# EasyEDA Pro project 电动自行车定位监测终端_v1.0.0.epro, board 主板PCB
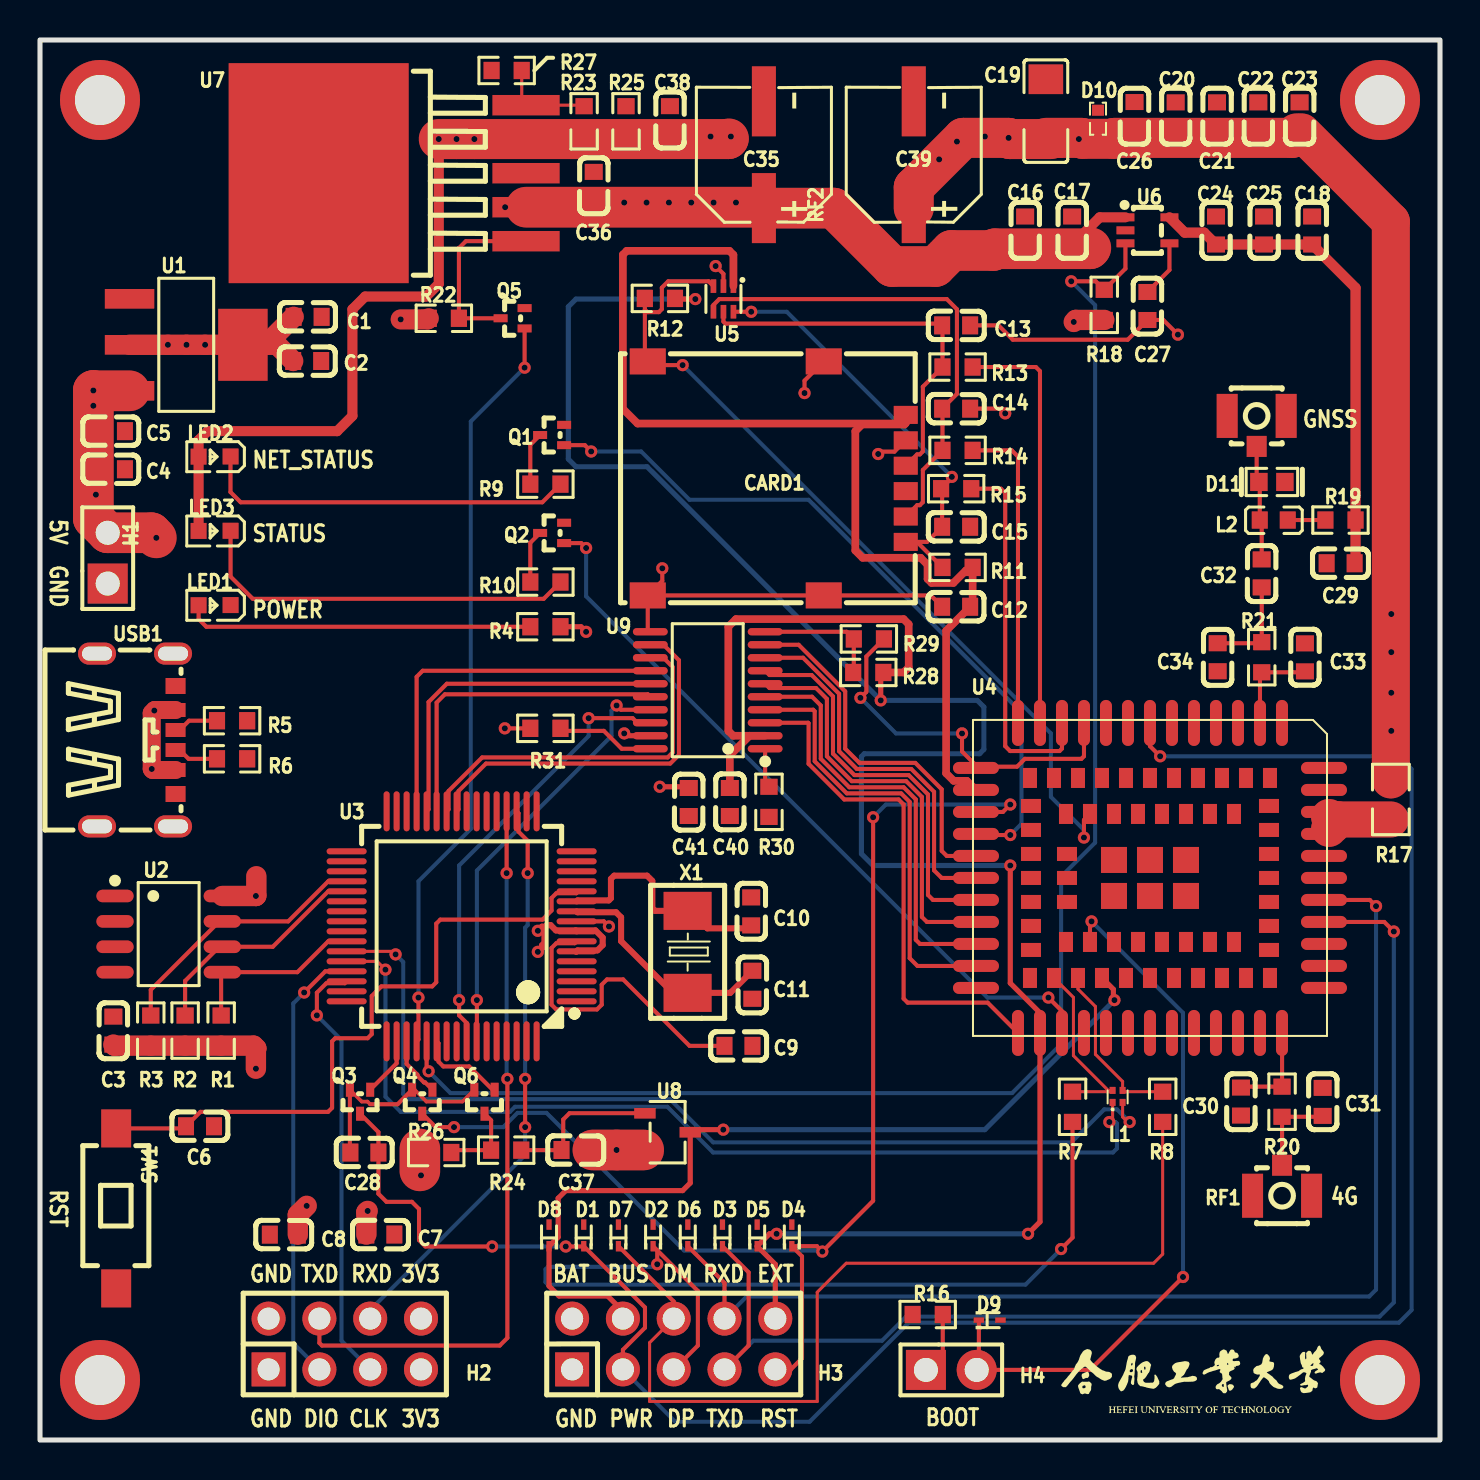
[diagram p3: board, top side]
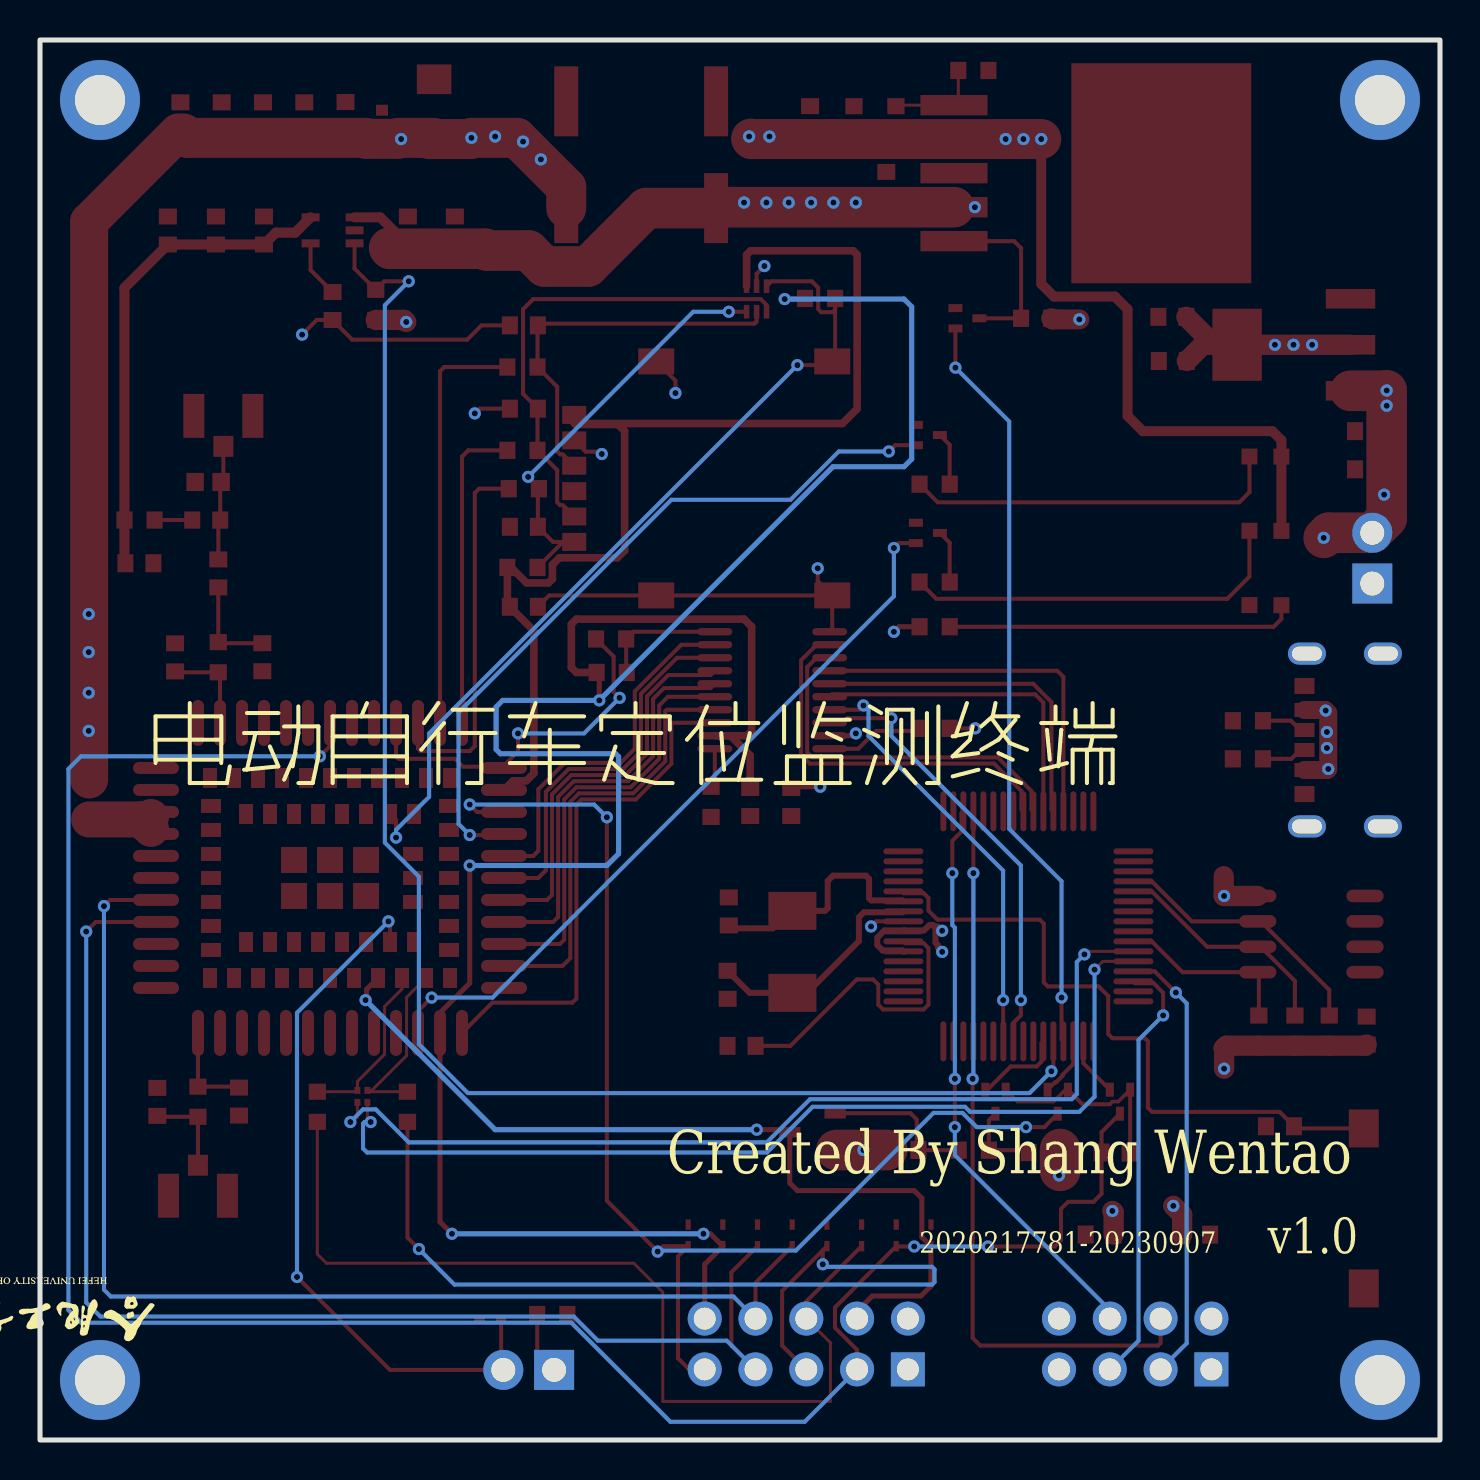
[diagram p4: board, bottom side, seen from below]

Outline 70 x 70 mm; copper layers: Top Layer, GND, PWR, Bottom Layer. Coordinates in mm from the lower left corner of the outline.
Outline path: rectangle 0,70 70,0
Stack: Top Layer 0.035mm 外层铜厚1oz / Dielectric1 0.2104mm 7628 RC49% 8.6mil / GND 0.0152mm 内层铜厚 / Dielectric2 1.065mm 1.1mm H/HOZ 含铜 / PWR 0.0152mm 内层铜厚 / Dielectric3 0.2104mm 7628 RC49% 8.6mil / Bottom Layer 0.035mm 外层铜厚1oz

## Design rules (mm)
net MCU_USB_DP: DP2
net MCU_USB_DM: DP2
net $1N2161: X1
net USB_DP_TEST: DP1
net USB_DM_TEST: DP1
net $1N19614: X1
template: 自定义配置
spacing copperThickness1oz (default): track to track 0.102, other pairs 0.152 to 0.3
spacing copperThickness2oz: track to track 0.203, other pairs 0.152 to 0.3
spacing copperThicknessInner0.5oz: track to track 0.089, other pairs 0.152 to 0.3
track width copperThickness1oz (default): min 0.102, default 0.203, max 0.203
track width copperThickness2oz: min 0.203, default 0.254, max 0.254
track width copperThickness0.5oz: min 0.089, default 0.203, max 2.54
track width 3V3: min 0.254, default 0.762, max 1.016
track width 3V8: min 0.254, default 1.016, max 2.54
track width 5V: min 0.254, default 2.032, max 3.048
track width 1V8: min 0.254, default 0.508, max 1.27
differential pair differentialPair (default): width min 0.127, default 0.254, max 2.54; gap min 0.152, default 0.152
via viaSize (default): diameter min 0.3, default 0.61, max 10; hole min 0.201, default 0.305, max 6.299
net 3V3 uses 3V3
net 5V uses 5V
net USB_VBUS uses 5V
net VBAT_MODULE uses 3V8
net VDD_EXT uses 1V8
net USIM1_VDD uses 1V8
net VBAT uses 3V8
net GNSS_VDD_3V3 uses 3V3

## Placement (name value [footprint] x y rotation side)
C1  100nF  [C0603]  13.38 56.16 0 top
C2  10uF  [C0603]  13.36 53.95 180 top
C3  100nF  [C0603]  3.67 20.47 90 top
C4  10uF  [C0603]  3.55 48.54 0 top
C5  100nF  [C0603]  3.55 50.44 0 top
C6  100nF  [C0603]  8 15.69 0 top
C7  100nF  [C0603]  17.02 10.27 180 top
C8  100nF  [C0603]  12.19 10.27 0 top
C9  100nF  [C0603]  34.92 19.71 180 top
C10  20pF  [C0603]  35.56 26.43 270 top
C11  20pF  [C0603]  35.62 22.76 90 top
C12  100nF  [C0603]  45.81 41.66 0 top
C13  33pF  [C0603]  45.81 55.73 180 top
C14  33pF  [C0603]  45.81 51.57 180 top
C15  33pF  [C0603]  45.81 45.66 180 top
C16  1uF  [C0603]  49.26 60.47 270 top
C17  100nF  [C0603]  51.61 60.47 270 top
C18  33pF  [C0603]  63.61 60.47 270 top
C19  100uF  [C1206]  50.29 66.44 270 top
C20  33pF  [C0603]  56.78 66.18 270 top
C21  10pF  [C0603]  58.85 66.18 270 top
C22  3.9pF  [C0603]  60.91 66.18 270 top
C23  1.8pF  [C0603]  62.98 66.18 270 top
C24  4.7uF  [C0603]  58.8 60.47 270 top
C25  100nF  [C0603]  61.2 60.47 270 top
C26  100nF  [C0603]  54.73 66.2 90 top
C27  10nF  [C0603]  55.37 56.7 90 top
C28  10nF  [C0603]  16.22 14.37 0 top
C29  100nF  [C0603]  65.03 43.84 0 top
C30  NM  [C0603]  60.05 16.92 90 top
C31  NM  [C0603]  64.13 16.91 270 top
C32  100pF  [C0603]  61.08 43.33 90 top
C33  NM  [C0603]  63.25 39.13 270 top
C34  NM  [C0603]  58.88 39.14 90 top
C35  470uF  [CAP-SMD_BD6.3-L6.6-W6.6-FD]  36.19 64.26 90 top
C36  100nF  [C0603]  27.69 62.71 270 top
C37  470nF  [C0603]  26.78 14.5 180 top
C38  100nF  [C0603]  31.5 65.99 270 top
C39  470uF  [CAP-SMD_BD6.3-L6.6-W6.6-FD]  43.69 64.26 90 top
C40  100nF  [C0603]  34.49 31.9 270 top
C41  100nF  [C0603]  32.44 31.9 90 top
CARD1  SMN-305-ARP7  [NANO-SIM-SMD_SMN-305-ARP7]  36.84 48.08 270 top
D1  ESD9L5.0ST5G  [SOD-923_L0.8-W0.6-LS1.0-RD]  27.19 10.23 90 top
D2  ESD9L5.0ST5G  [SOD-923_L0.8-W0.6-LS1.0-RD]  30.66 10.23 90 top
D3  ESD9L5.0ST5G  [SOD-923_L0.8-W0.6-LS1.0-RD]  34.12 10.23 90 top
D4  ESD9L5.0ST5G  [SOD-923_L0.8-W0.6-LS1.0-RD]  37.59 10.23 90 top
D5  ESD9L5.0ST5G  [SOD-923_L0.8-W0.6-LS1.0-RD]  35.86 10.23 90 top
D6  ESD9L5.0ST5G  [SOD-923_L0.8-W0.6-LS1.0-RD]  32.39 10.23 90 top
D7  ESD9L5.0ST5G  [SOD-923_L0.8-W0.6-LS1.0-RD]  28.92 10.23 90 top
D8  ESD9L5.0ST5G  [SOD-923_L0.8-W0.6-LS1.0-RD]  25.45 10.23 90 top
D9  ESD9L5.0ST5G  [SOD-923_L0.8-W0.6-LS1.0-RD]  47.48 5.99 0 top
D10  PESDNC2FD4V5B  [DFN1006-2L-BI]  52.9 66.06 90 top
D11  KPESD0603AV5  [D0603-BI-A]  61.59 47.9 180 top
H1  PZ254V-11-02P  [HDR-TH_2P-P2.54-V-M]  3.39 44.09 90 top
H2  PZ254V-12-8P  [HDR-TH_8P-P2.54-V-M-R2-C4-S2.54]  15.24 4.8 0 top
H3  PZ254V-12-10P  [HDR-TH_10P-P2.54-V-M-R2-C5-S2.54]  31.69 4.8 0 top
H4  PZ254V-11-02P  [HDR-TH_2P-P2.54-V-M]  45.57 3.5 0 top
L1  DLM0NSN900HY2D  [FILTER-SMD_4P-L0.9-W0.7-P0.50-BL-CW]  53.88 17.18 0 top
L2  47nH  [L0603]  61.69 46 180 top
LED1  XL-1608UGC-04  [LED0603-RD_GREEN]  8.73 41.74 180 top
LED2  XL-1608UBC-04  [LED0603-RD_BLUE]  8.73 49.17 180 top
LED3  XL-1608UBC-04  [LED0603-RD_BLUE]  8.73 45.46 180 top
NOREF  -  [Pad_e67]  3 3 90 top
NOREF#2  -  [Pad_e65]  67 67 270 top
NOREF#3  -  [Pad_e66]  67 3 180 top
NOREF#4  -  [Pad_e10]  3 67 0 top
Q1  DTC043ZEBTL  [SOT-416_L1.6-W0.8-P1.00-LS1.6-BR]  25.6 50.25 0 top
Q2  DTC043ZEBTL  [SOT-416_L1.6-W0.8-P1.00-LS1.6-BR]  25.6 45.35 0 top
Q3  DTC043ZEBTL  [SOT-416_L1.6-W0.8-P1.00-LS1.6-BR]  16 16.91 90 top
Q4  DTC043ZEBTL  [SOT-416_L1.6-W0.8-P1.00-LS1.6-BR]  19.11 16.91 90 top
Q5  DTC043ZEBTL  [SOT-416_L1.6-W0.8-P1.00-LS1.6-BR]  23.63 56.09 0 top
Q6  DTC043ZEBTL  [SOT-416_L1.6-W0.8-P1.00-LS1.6-BR]  22.22 16.91 90 top
R1  10kΩ  [R0603]  9.06 20.47 270 top
R2  10kΩ  [R0603]  7.26 20.47 270 top
R3  10kΩ  [R0603]  5.54 20.47 270 top
R4  510Ω  [R0603]  25.27 40.66 180 top
R5  5.1kΩ  [R0603]  9.6 35.96 180 top
R6  5.1kΩ  [R0603]  9.6 34.06 180 top
R7  NM-0R  [R0603]  51.63 16.66 90 top
R8  NM-0R  [R0603]  56.13 16.66 90 top
R9  2.2kΩ  [R0603]  25.27 47.79 0 top
R10  2.2kΩ  [R0603]  25.27 42.9 0 top
R11  15kΩ  [R0603]  45.88 43.63 0 top
R12  51kΩ  [R0603]  31 57.08 0 top
R13  0Ω  [R0603]  45.88 53.65 180 top
R14  0Ω  [R0603]  45.88 49.48 180 top
R15  0Ω  [R0603]  45.81 47.56 180 top
R16  4.7kΩ  [R0603]  44.38 6.27 0 top
R17  0Ω  [R0805]  67.54 32.03 270 top
R18  10kΩ  [R0603]  53.21 56.76 90 top
R19  10Ω  [R0603]  65.02 46 180 top
R20  0Ω  [R0603]  62.1 16.91 270 top
R21  0Ω  [R0603]  61.09 39.14 90 top
R22  51kΩ  [R0603]  20.19 56.09 0 top
R23  100kΩ  [R0603]  27.21 65.94 270 top
R24  100kΩ  [R0603]  23.31 14.49 0 top
R25  330Ω  [R0603]  29.3 65.94 270 top
R26  10kΩ  [R0603]  19.81 14.37 180 top
R27  47kΩ  [R0603]  23.33 68.48 0 top
R28  10kΩ  [R0603]  41.41 38.38 0 top
R29  120kΩ  [R0603]  41.44 40.05 180 top
R30  51kΩ  [R0603]  36.45 31.91 270 top
R31  51kΩ  [R0603]  25.27 35.58 0 top
RF1  BWIPX-1-001E  [IPEX-SMD_BWIPX-1-001E]  62.1 12.98 270 top
RF2  BWIPX-1-001E  [IPEX-SMD_BWIPX-1-001E]  60.83 50.44 90 top
SW1  TS-1101-C-W  [SW-SMD_L6.0-W3.3-LS8.0]  3.81 11.58 270 top
U1  AMS1117-3.3  [SOT-223-4_L6.5-W3.5-P2.30-LS7.0-BR]  7.31 54.76 180 top
U2  AT24C64M/TR  [SOP-8_L4.9-W3.9-P1.27-LS6.0-BL]  6.43 25.3 270 top
U3  STM32G0B0RET6  [LQFP-64_L10.0-W10.0-P0.50-LS12.0-BL]  21.08 25.68 90 top
U4  -  [EC800M-CN_QuecOpen]  55.5 28.1 270 top
U5  ESDA6V8AV6  [SOT-563-6_L1.6-W1.2-P0.50-LS1.6-BL]  34.17 57.05 180 top
U6  SGM2019-3.3YC5G/TR  [SC-70-5_L2.1-W1.3-P0.65-LS2.1-BR]  55.37 60.48 180 top
U7  MIC29302WU  [TO-263-5_L10.1-W8.7-P1.70-LS15.2-BR]  19.12 63.34 0 top
U8  SI2333CDS-T1-MS  [SOT-23-3_L3.0-W1.6-P1.90-LS2.8-BR]  31.38 15.39 180 top
U9  TXS0108EPWR  [TSSOP-20_L6.5-W4.4-P0.65-LS6.4-BL]  33.39 37.49 90 top
USB1  TYPE-C 6P(073)  [TYPE-C-SMD_TYPE-C-6P]  4.81 35 270 top
X1  8MHz  [CRYSTAL-SMD_L5.0-W3.2]  32.38 24.41 90 top

## Footprints (pads in the part's own frame, mm; a bottom-side part is the same pattern mirrored in y, then rotated)
C0603
  rect 0.8x0.9 smd: 1(-0.7,0) 2(0.7,0)
C1206
  rect 1.485x1.728 smd: 1(-1.593,0) 2(1.593,0)
CAP-SMD_BD6.3-L6.6-W6.6-FD
  rect 3.5x1.2 smd: 1(-2.67,0) 2(2.67,0)
CRYSTAL-SMD_L5.0-W3.2
  rect 1.9x2.4 smd: 1(-2.05,0) 2(2.05,0)
D0603-BI-A
  rect 0.873x0.907 smd: 1(-0.65,0) 2(0.65,0)
DFN1006-2L-BI
  rect 0.55x0.6 smd: 1(-0.425,0) 2(0.425,0)
EC800M-CN_QuecOpen
  oval 2.3x0.6 smd: 1(-7.75,6.6) 2(-7.75,5.5) 3(-7.75,4.4) 4(-7.75,3.3) 5(-7.75,2.2) 6(-7.75,1.1) 7(-7.75,0) 8(-7.75,-1.1) 9(-7.75,-2.2) 10(-7.75,-3.3) 11(-7.75,-4.4) 12(-7.75,-5.5) 13(-7.75,-6.6) 23(7.75,-6.6) 24(7.75,-5.5) 25(7.75,-4.4) 26(7.75,-3.3) 27(7.75,-2.2) 28(7.75,-1.1) 29(7.75,0) 30(7.75,1.1) 31(7.75,2.2) 32(7.75,3.3) 33(7.75,4.4) 34(7.75,5.5) 35(7.75,6.6)
  oval 0.6x2.3 smd: 14(-4.4,-8.7) 15(-3.3,-8.7) 16(-2.2,-8.7) 17(-1.1,-8.7) 18(0,-8.7) 19(1.1,-8.7) 20(2.2,-8.7) 21(3.3,-8.7) 22(4.4,-8.7) 36(4.4,8.7) 37(3.3,8.7) 38(2.2,8.7) 39(1.1,8.7) 40(0,8.7) 41(-1.1,8.7) 42(-2.2,8.7) 43(-3.3,8.7) 44(-4.4,8.7) 95(-5.5,-8.7) 96(5.5,-8.7) 97(5.5,8.7) 98(-5.5,8.7)
  rect 1x0.7 smd: 45(-5,4.8) 46(-5,3.6) 47(-5,2.4) 48(-5,1.2) 49(-5,0) 50(-5,-1.2) 51(-5,-2.4) 52(-5,-3.6) 53(-5,-4.8) 59(5,-4.8) 60(5,-3.6) 61(5,-2.4) 62(5,-1.2) 63(5,0) 64(5,1.2) 65(5,2.4) 66(5,3.6) 67(5,4.8) 73(-3.2,4.2) 74(-3.2,3) 75(-3.2,1.8) 76(-3.2,0.6) 77(-3.2,-0.6) 78(-3.2,-1.8) 79(-3.2,-3) 80(-3.2,-4.2) 81(3.2,-4.2) 82(3.2,-3) 83(3.2,-1.8) 84(3.2,-0.6) 85(3.2,0.6) 86(3.2,1.8) 87(3.2,3) 88(3.2,4.2) 99(-5,6) 100(-5,-6) 103(5,-6) 104(5,6)
  rect 0.7x1 smd: 54(-2.4,-5.95) 55(-1.2,-5.95) 56(0,-5.95) 57(1.2,-5.95) 58(2.4,-5.95) 68(2.4,5.95) 69(1.2,5.95) 70(0,5.95) 71(-1.2,5.95) 72(-2.4,5.95) 101(-3.6,-5.95) 102(3.6,-5.95) 105(3.6,5.95) 106(-3.6,5.95) 107(-1.2,-4.15) 108(0,-4.15) 109(1.2,-4.15)
  rect 1.3x1.3 smd: 89(-0.9,1.8) 90(-0.9,0) 91(-0.9,-1.8) 92(0.9,-1.8) 93(0.9,0) 94(0.9,1.8)
FILTER-SMD_4P-L0.9-W0.7-P0.50-BL-CW
  rect 0.3x0.35 smd: 1(-0.25,-0.3) 2(-0.25,0.3) 3(0.25,0.3) 4(0.25,-0.3)
HDR-TH_2P-P2.54-V-M
  rect 2x2 hole 1.2: 1(-1.27,0)
  round 2 hole 1.2: 2(1.27,0)
HDR-TH_8P-P2.54-V-M-R2-C4-S2.54
  rect 1.7x1.7 hole 1.1: 1(-3.81,-1.27)
  round 1.7 hole 1.1: 2(-3.81,1.27) 3(-1.27,-1.27) 4(-1.27,1.27) 5(1.27,-1.27) 6(1.27,1.27) 7(3.81,-1.27) 8(3.81,1.27)
HDR-TH_10P-P2.54-V-M-R2-C5-S2.54
  rect 1.7x1.7 hole 1.1: 1(-5.08,-1.27)
  round 1.7 hole 1.1: 2(-5.08,1.27) 3(-2.54,-1.27) 4(-2.54,1.27) 5(0,-1.27) 6(0,1.27) 7(2.54,-1.27) 8(2.54,1.27) 9(5.08,-1.27) 10(5.08,1.27)
IPEX-SMD_BWIPX-1-001E
  rect 1.05x1 smd: 1(-0.762,0)
  rect 2.2x1.05 smd: 2(0.762,-1.475) 3(0.762,1.475)
L0603
  rect 0.8x0.864 smd: 1(-0.7,0) 2(0.7,0)
LED0603-RD_BLUE
  rect 0.8x0.8 smd: 1(-0.799,-0.004) 2(0.799,0.004)
LED0603-RD_GREEN
  rect 0.8x0.8 smd: 1(-0.799,-0.004) 2(0.799,0.004)
LQFP-64_L10.0-W10.0-P0.50-LS12.0-BL
  oval 0.3x2 smd: 1(-3.75,-5.75) 2(-3.25,-5.75) 3(-2.75,-5.75) 4(-2.25,-5.75) 5(-1.75,-5.75) 6(-1.25,-5.75) 7(-0.75,-5.75) 8(-0.25,-5.75) 9(0.25,-5.75) 10(0.75,-5.75) 11(1.25,-5.75) 12(1.75,-5.75) 13(2.25,-5.75) 14(2.75,-5.75) 15(3.25,-5.75) 16(3.75,-5.75) 33(3.75,5.75) 34(3.25,5.75) 35(2.75,5.75) 36(2.25,5.75) 37(1.75,5.75) 38(1.25,5.75) 39(0.75,5.75) 40(0.25,5.75) 41(-0.25,5.75) 42(-0.75,5.75) 43(-1.25,5.75) 44(-1.75,5.75) 45(-2.25,5.75) 46(-2.75,5.75) 47(-3.25,5.75) 48(-3.75,5.75)
  oval 2x0.3 smd: 17(5.75,-3.75) 18(5.75,-3.25) 19(5.75,-2.75) 20(5.75,-2.25) 21(5.75,-1.75) 22(5.75,-1.25) 23(5.75,-0.75) 24(5.75,-0.25) 25(5.75,0.25) 26(5.75,0.75) 27(5.75,1.25) 28(5.75,1.75) 29(5.75,2.25) 30(5.75,2.75) 31(5.75,3.25) 32(5.75,3.75) 49(-5.75,3.75) 50(-5.75,3.25) 51(-5.75,2.75) 52(-5.75,2.25) 53(-5.75,1.75) 54(-5.75,1.25) 55(-5.75,0.75) 56(-5.75,0.25) 57(-5.75,-0.25) 58(-5.75,-0.75) 59(-5.75,-1.25) 60(-5.75,-1.75) 61(-5.75,-2.25) 62(-5.75,-2.75) 63(-5.75,-3.25) 64(-5.75,-3.75)
NANO-SIM-SMD_SMN-305-ARP7
  rect 0.9x1.2 smd: 1(-3.175,6.45) 2(-0.635,6.45) 3(1.905,6.45) 5(-1.905,6.45) 6(0.635,6.45) 7(3.175,6.45)
  rect 1.3x1.8 smd: 8(-5.85,-6.45) 9(-5.85,2.35) 10(5.85,2.35) 11(5.85,-6.45)
Pad_e10
  round 4 hole 2.5: 110(0,0)
Pad_e65
  round 4 hole 2.5: 110(0,0)
Pad_e66
  round 4 hole 2.5: 110(0,0)
Pad_e67
  round 4 hole 2.5: 110(0,0)
R0603
  rect 0.806x0.864 smd: 1(-0.753,0) 2(0.753,0)
R0805
  rect 1.133x1.377 smd: 1(-1,0) 2(1,0)
SC-70-5_L2.1-W1.3-P0.65-LS2.1-BR
  rect 0.9x0.4 smd: 1(1.1,-0.65) 2(1.1,0) 3(1.1,0.65) 4(-1.1,0.65) 5(-1.1,-0.65)
SOD-923_L0.8-W0.6-LS1.0-RD
  rect 0.52x0.26 smd: 1(-0.54,0) 2(0.54,0)
SOP-8_L4.9-W3.9-P1.27-LS6.0-BL
  oval 0.63x1.865 smd: 1(-1.905,-2.683) 2(-0.635,-2.683) 3(0.635,-2.683) 4(1.905,-2.683) 5(1.905,2.683) 6(0.635,2.683) 7(-0.635,2.683) 8(-1.905,2.683)
SOT-23-3_L3.0-W1.6-P1.90-LS2.8-BR
  rect 1.07x0.532 smd: 1(1.135,-0.95) 2(1.135,0.95) 3(-1.135,0)
SOT-223-4_L6.5-W3.5-P2.30-LS7.0-BR
  rect 2.47x0.98 smd: 1(2.835,-2.3) 2(2.835,0) 3(2.835,2.3)
  rect 2.47x3.6 smd: 4(-2.835,0)
SOT-416_L1.6-W0.8-P1.00-LS1.6-BR
  rect 0.7x0.4 smd: 1(0.6,-0.508) 2(0.6,0.508) 3(-0.6,0)
SOT-563-6_L1.6-W1.2-P0.50-LS1.6-BL
  rect 0.28x0.68 smd: 1(-0.5,-0.64) 2(0,-0.64) 3(0.5,-0.64) 4(0.5,0.64) 5(0,0.64) 6(-0.5,0.64)
SW-SMD_L6.0-W3.3-LS8.0
  rect 1.9x1.5 smd: 1(-4,0) 2(4,0)
TO-263-5_L10.1-W8.7-P1.70-LS15.2-BR
  rect 3.358x1.02 smd: 1(5.183,-3.4) 2(5.183,-1.7) 3(5.183,0) 4(5.183,1.7) 5(5.183,3.4)
  rect 9x11 smd: 6(-5.184,0)
TSSOP-20_L6.5-W4.4-P0.65-LS6.4-BL
  oval 0.364x1.742 smd: 1(-2.925,-2.871) 2(-2.275,-2.871) 3(-1.625,-2.871) 4(-0.975,-2.871) 5(-0.325,-2.871) 6(0.325,-2.871) 7(0.975,-2.871) 8(1.625,-2.871) 9(2.275,-2.871) 10(2.925,-2.871) 11(2.925,2.871) 12(2.275,2.871) 13(1.625,2.871) 14(0.975,2.871) 15(0.325,2.871) 16(-0.325,2.871) 17(-0.975,2.871) 18(-1.625,2.871) 19(-2.275,2.871) 20(-2.925,2.871)
TYPE-C-SMD_TYPE-C-6P
  oval 1.1x1.9 hole 0.7x1.5: 7(-4.32,1.837) 7(-4.32,-1.962) 7(4.32,1.837) 7(4.32,-1.962)
  rect 0.7x1 smd: A5(-0.5,1.962) A9(1.5,1.962) B5(0.5,1.962) B9(-1.5,1.962)
  rect 0.8x1 smd: A12(2.7,1.962) B12(-2.7,1.962)

## Nets
As in the schematic, except:
GND: C1.2 C2.1 C3.2 C4.2 C5.2 C6.2 C7.1 C8.1 C9.1 C10.1 C11.1 C12.1 C13.1 C14.1 C15.1 C16.1 C17.1 C18.1 C19.1 C20.1 C21.1 C22.1 C23.1 C24.1 C25.1 C26.2 C27.1 C28.1 C29.1 C30.1 C31.1 C33.1 C34.1 C35.2 C36.1 C38.1 C39.2 C40.2 C41.1 CARD1.5 CARD1.9 CARD1.10 CARD1.11 D1.2 D2.2 D3.2 D4.2 D5.2 D6.2 D7.2 D8.2 D9.2 D10.2 D11.1 H1.1 H2.1 H2.2 H3.1 LED1.1 NOREF.110 NOREF#2.110 NOREF#3.110 NOREF#4.110 Q1.2 Q2.2 Q3.2 Q4.2 Q5.2 Q6.2 R5.1 R6.1 R16.1 R25.1 R27.1 R29.1 R30.2 R31.1 RF1.2 RF1.3 RF2.2 RF2.3 SW1.2 U1.1 U2.1 U2.2 U2.3 U2.4 U3.9 U4.1 U4.10 U4.27 U4.34 U4.36 U4.37 U4.40 U4.41 U4.45 U4.46 U4.47 U4.48 U4.70 U4.71 U4.72 U4.73 U4.88 U4.89 U4.90 U4.91 U4.92 U4.93 U4.94 U4.95 U5.2 U6.2 U7.3 U7.6 U9.11 USB1.7 USB1.A12 USB1.B12

Pads without a net: CARD1 6; U3 1 2 3 4 5 13 14 15 16 17 18 21 22 23 24 30 31 32 33 34 35 38 39 40 41 47 48 49 55 56 59 60 61 62 63 64; U4 3 4 5 6 8 9 26 28 29 30 31 32 33 44 49 50 51 52 53 54 55 56 57 58 62 63 64 65 66 67 68 69 74 75 76 77 78 80 81 83 84 85 86 87 96 97 98 99 100 101 102 103 104 105 106 107 108 109

## Via types
v1: diameter 0.61, hole 0.305, Top Layer to Bottom Layer, 102 vias

## Routing (per net, layer and track width the routed paths; a pad name or vN(x,y) marks a point on that pad's centre or on a via; arc(x,y) is an arc through that point)
3V3: length 37
  Top Layer w0.254: v1(30.99,32.66) 32.38,32.66 C41.2 ; v1(29.21,35.33) 29.33,35.21 U9.19 ; v1(27.31,40.41) 27.05,40.66 R4.1
  Top Layer w0.3: v1(24.89,25.46) 25.1,25.67 25.27,25.67 ; 26.78,25.48 27.77,25.48 28.13,25.12 28.13,24.75 27.87,24.48 26.88,24.48 U3.6 26.81,24.41 ; 26.78,25.48 U3.8 ; 26.78,25.48 25.79,25.48 25.53,25.75 25.35,25.75 25.27,25.67 ; 25.27,25.67 25.22,25.62 25.22,24.86 25.1,24.73 25.1,24.61 v1(24.89,24.41)
  Top Layer w1.016: 11.29,54.76 11.85,54.76 C2.2 ; 11.29,54.76 C1.1 ; 11.29,54.76 v1(8.25,54.76) v1(7.33,54.76) v1(6.39,54.76) U1.2 ; C3.1 3.72,19.72 R3.2 R2.2 R1.2 10.68,19.72 10.82,19.58 10.8,19.56 v1(10.8,18.56) ; 9.11,27.2 v1(10.8,27.2) 10.82,27.22 10.82,28.19 ; C8.2 12.89,11.26 v1(13.33,11.71) ; v1(16.38,11.45) 16.32,11.39 C7.2 ; R18.1 51.79,56 v1(51.69,55.9)
5V: length 55.2
  Top Layer w0.5: U6.1 52.98,61.13 51.63,59.78 51.61,59.78
  Top Layer w0.9: USB1.A9 5.64,33.5 v1(5.59,33.55) 5.59,36.34 v1(5.72,36.47) 5.74,36.5 USB1.B9
  Top Layer w1: R22.1 19.38,56.03 v1(18.03,56.03)
  Top Layer w2.032: 30.18,14.5 v1(28.83,14.5) 27.64,14.5 ; 18.99,14.55 18.99,13.46 ; 24.3,61.64 36.15,61.64 C35.1 39.69,61.59 42.6,58.67 44.77,58.67 45.57,59.48 47.66,59.48 47.74,59.56 52.5,59.56 52.54,59.61 ; v1(5.82,45.11) 5.56,45.36 H1.2 2.67,46.08 v1(2.67,51.71) v1(2.67,52.47) 2.68,52.46 U1.3
  vias: v1(2.79,47.27) v1(5.65,35.4) v1(5.65,34.6) v1(19.05,13.23) v1(23.26,61.64) v1(29.21,61.87) v1(30.33,61.87) v1(31.44,61.87) v1(32.56,61.87) v1(33.68,61.87) v1(34.8,61.87)
GND: length 68.4
  Top Layer w0.18: Q4.2 18.73,17.51 19.32,16.92 21.12,16.92 Q6.2 ; 16.51,16.79 16.38,16.92 16.09,16.92 Q3.2
  Top Layer w0.203: R29.1 41.32,39.17 41.32,37.4 v1(41.02,37.11) ; 46.86,33.67 46.1,34.43 v1(46.1,35.33) ; 46.86,33.67 U4.95 ; 46.86,33.67 48.85,33.67 49.25,34.06 52.07,34.06 52.2,34.19 52.2,35.85 ; C28.1 15.49,14.4 Q3.2 ; U9.11 30.39,40.54 CARD1.11 ; CARD1.11 31.12,42.96 v1(31.12,43.58) ; CARD1.11 CARD1.10 44.54,42.23 C12.1 ; v1(33.78,58.7) 34.17,58.31 U5.2 ; v1(38.23,52.35) 38.23,52.97 CARD1.9 ; R31.1 v1(23.24,35.58) ; Q4.2 17.88,16.79 16.51,16.79 ; 48.13,51.46 48.02,51.57 46.51,51.57 ; v1(28.45,25.68) 28.19,25.93 U3.9 ; CARD1.5 42.72,49.42 42.03,49.42 v1(41.91,49.3) ; 46.51,55.73 47.92,55.73 48.64,55.01 54.38,55.01 C27.1 56.16,56 v1(56.9,55.27)
  Bottom Layer w0.203: v1(41.02,37.11) 42.8,35.33 v1(46.1,35.33)
  vias: v1(48.26,51.33)
VBAT: length 100.5
  Top Layer w0.5: v1(19.94,65.05) 19.94,57.81 19.3,57.17 16.26,57.17 15.62,56.54 15.62,51.2 14.86,50.44 8.38,50.44 7.93,49.99 LED2.2 LED3.2
  Top Layer w1.9: 63.08,65.38 67.54,60.92 R17.1
  Top Layer w2: C39.1 43.69,62.63 46.16,65.11 v1(48.43,65.11) 48.49,65.05 50.55,65.05 ; 34.44,65.07 34.42,65.05 v1(21.72,65.05) v1(20.83,65.05) v1(19.94,65.05) ; 62.83,65.33 62.6,65.11 53.72,65.11 53.68,65.06 52.12,65.06 52.08,65.11 50.29,65.11
  vias: v1(33.53,65.17) v1(34.54,65.17) v1(44.96,64.03) v1(45.85,64.92) v1(47.24,65.17) v1(51.94,65.05) v1(67.56,41.3) v1(67.56,39.39) v1(67.56,37.36) v1(67.56,35.46)
VBAT_EN: length 37.9
  Top Layer w0.203: 24.23,55.58 v1(24.23,53.62) ; v1(18.92,22.12) 18.92,20.02 U3.52
  Bottom Layer w0.203: v1(24.23,53.62) 21.54,50.93 21.54,30.55 18.92,27.94 v1(18.92,22.12)
VBAT_MODULE: length 3.8
  Top Layer w1.8: R17.2 64.92,31.03 ; 64.92,31.03 64.57,31.03 64.45,31.15 ; 64.92,31.03 64.45,30.56
VBUS_CTRL: length 4.4
  Top Layer w0.203: Q6.1 22.63,17.51 21.46,18.68 20.16,18.68 19.93,18.92 19.93,19.84 U3.54
VDD_EXT: length 123.5
  Top Layer w0.254: v1(42.04,36.98) 42.04,38.25 R28.2 ; v1(36.83,10.31) 36.48,10.31 D5.1 36.77,8.78 H3.10 ; R12.2 31.78,57.05 v1(32.77,57.05) ; v1(48.51,28.72) 48.51,22.84 50,21.36 U4.24 50,10.91 v1(49.4,10.31)
  Top Layer w0.381: 35.48,35.21 34.49,34.23 C40.1 ; 35.48,35.21 34.66,35.21 34.42,35.46 34.42,40.66 34.8,41.04 43.18,41.04 43.43,40.79 43.43,38.63 43.18,38.38 R28.2 ; 35.48,35.21 U9.2
  Bottom Layer w0.254: v1(49.4,10.31) v1(36.83,10.31) ; v1(48.51,28.72) 41.66,28.72 41.07,29.31 41.07,34.17 41.21,34.31 46.98,34.31 47.19,34.53 47.19,36.65 46.86,36.98 v1(42.04,36.98) 30.35,48.66 26.8,48.66 26.42,49.05 26.42,56.67 26.8,57.05 v1(32.77,57.05)
ANT_GNSS: length 4.7
  Top Layer w0.203: U4.2 61,38.3 R21.1 63.2,38.39 C33.2
ANT_MAIN: length 4.8
  Top Layer w0.203: C30.2 60.09,17.67 R20.1 62.1,20.35 U4.35
CC1: length 2.3
  Top Layer w0.203: USB1.A5 6.99,35.5 7.45,35.96 R5.2
CC2: length 2.3
  Top Layer w0.203: USB1.B5 6.99,34.5 7.43,34.06 R6.2
CTS_MCU: length 21.5
  Top Layer w0.203: v1(28.83,36.73) 29.04,36.51 U9.17 ; v1(21.84,21.99) 21.84,19.94 U3.58
  Bottom Layer w0.203: v1(28.83,36.73) 28.57,36.47 28.57,35.2 21.84,28.47 v1(21.84,21.99)
DBG_RXD: length 64.3
  Top Layer w0.203: H3.7 34.24,3.53 35.43,4.72 35.43,8.38 D3.1 ; 64.2,25.9 67.21,25.9 v1(67.69,25.42)
  Bottom Layer w0.203: v1(67.69,25.42) 67.69,6.88 66.98,6.17 43.31,6.17 42.1,4.97 35.66,4.97 H3.7
DBG_TXD: length 59.5
  Top Layer w0.203: 64.2,27 66.49,27 v1(66.8,26.69) ; D6.1 34.23,7.85 H3.8
  Bottom Layer w0.203: H3.8 35.33,7.17 66.46,7.17 66.8,7.52 v1(66.8,26.69)
DCD_MCU: length 16.3
  Top Layer w0.203: U3.27 19.83,36.87 20.24,37.29 30.39,37.29 U9.16
DEBUG_RX: length 37.2
  Top Layer w0.203: U3.20 v1(23.33,28.34) ; H2.4 13.97,4.85 14.1,4.72 22.99,4.72 23.37,5.1 v1(23.37,18.06)
  Bottom Layer w0.203: v1(23.37,18.06) 23.33,18.09 v1(23.33,28.34)
DEBUG_TX: length 28.9
  Top Layer w0.203: U3.19 23.93,31.34 23.93,30.42 24.38,29.96 v1(24.38,28.34) ; v1(24.26,18.06) v1(24.26,15.64)
  Bottom Layer w0.203: v1(24.26,18.06) 24.26,25.62 24.38,25.74 v1(24.38,28.34) ; H2.6 16.51,6.5 24.26,14.25 v1(24.26,15.64)
DTR_MCU: length 18.5
  Top Layer w0.203: U9.14 19.14,38.46 18.83,38.16 U3.29
GNSS_ANT_EN: length 78.6
  Top Layer w0.203: U6.3 54.27,58.57 R18.2 52.79,57.94 v1(51.56,57.94) ; v1(19.43,18.44) 19.33,18.54 U3.53
  Bottom Layer w0.203: v1(51.56,57.94) 52.76,56.74 52.76,29.87 51.05,28.17 51.05,19.79 48.61,17.35 20.52,17.35 v1(19.43,18.44)
GNSS_VDD_3V3: length 24.6
  Top Layer w0.508: U6.5 57.24,60.37 58.21,60.37 58.8,59.78 63.61,59.78 65.78,57.6 R19.1 65.78,43.88 C29.2
I2C1_SCL: length 11.7
  Top Layer w0.203: U3.37 14.41,27.43 11.64,24.66 U2.6 8.96,24.66 7.26,22.95 R2.1
I2C1_SDA: length 9
  Top Layer w0.203: U3.42 14.41,24.93 12.87,23.39 U2.5 9.06,23.33 R1.1
I2C1_WP: length 13.3
  Top Layer w0.203: R3.1 5.54,22.51 8.96,25.93 U2.7 12.41,25.93 14.41,27.93 U3.36
MAIN_CTS: length 21.9
  Top Layer w0.203: U9.4 38.66,36.51 38.74,36.44 38.74,33.94 40.34,32.33 43.06,32.33 43.49,31.9 43.49,24.09 43.87,23.7 U4.22
MAIN_DCD: length 21.3
  Top Layer w0.203: U9.5 38.6,37.16 39.04,36.73 39.04,34.06 40.47,32.64 43.18,32.64 43.79,32.03 43.79,25.01 44,24.8 U4.21
MAIN_DTR: length 19.9
  Top Layer w0.203: U4.19 44.65,27 44.4,27.25 44.4,32.28 43.43,33.25 40.72,33.25 39.65,34.31 39.65,37.18 38.58,38.25 36.47,38.25 U9.7
MAIN_RI: length 20.7
  Top Layer w0.203: U4.20 44.34,25.9 44.09,26.15 44.09,32.16 43.31,32.94 40.59,32.94 39.34,34.19 39.34,37.06 38.8,37.6 36.47,37.6 U9.6
MAIN_RTS: length 25.9
  Top Layer w0.203: U4.23 47.38,21.87 43.38,21.87 43.18,22.07 43.18,31.78 42.93,32.03 40.21,32.03 38.43,33.81 38.43,35.84 38.41,35.86 U9.3
MAIN_RXD: length 18.4
  Top Layer w0.203: U9.9 37.93,39.76 40.26,37.43 40.26,34.57 40.97,33.86 43.76,33.86 45.09,32.53 45.09,29.46 45.34,29.2 U4.17
MAIN_TXD: length 19.1
  Top Layer w0.203: U4.18 45.08,28.1 44.7,28.48 44.7,32.41 43.56,33.55 40.84,33.55 39.95,34.44 39.95,37.31 38.15,39.11 U9.8
MCU_USB_DM: length 49.1
  Top Layer w0.15: L1.4 54.13,16.15 54.38,15.9 v1(54.48,15.9) ; U3.43 17.63,24.43 v1(17.78,24.28)
  Bottom Layer w0.203: v1(54.48,15.9) 53.85,16.53 53.21,16.53 51.56,14.88 33.66,14.88 31.5,17.04 18.41,17.04 18.16,17.3 18.16,23.9 v1(17.78,24.28)
MCU_USB_DP: length 49.2
  Top Layer w0.15: v1(17.27,23.52) 16.86,23.93 U3.44 ; v1(53.47,15.9) 53.63,16.06 L1.1
  Bottom Layer w0.203: v1(53.47,15.9) 53.77,15.9 53.85,15.82 53.85,14.58 53.65,14.37 33.66,14.37 31.37,16.66 23.75,16.66 23.5,16.41 18.03,16.41 17.27,17.17 v1(17.27,23.52)
NET_STATUS: length 36.5
  Top Layer w0.203: v1(27.56,49.43) 27.24,49.74 Q1.1 ; U4.16 46.85,30.25 v1(48.51,30.25)
  Bottom Layer w0.203: v1(27.56,49.43) 30.06,49.43 32.47,47.01 38.43,47.01 49.07,36.37 49.07,30.81 v1(48.51,30.25)
NRST: length 33.1
  Top Layer w0.203: SW1.1 7.19,15.58 C6.1 8.02,16.41 14.4,16.41 14.61,16.61 14.61,19.94 14.76,20.09 16.38,20.09 16.59,20.29 16.59,22.2 17.07,22.68 19.61,22.68 19.81,22.88 19.81,25.82 20.01,26.02 25.12,26.02 25.58,26.47 25.58,27.1 25.81,27.34 26.81,27.34 26.83,27.35 U3.12
ON/OFF_MCU: length 3
  Top Layer w0.203: Q3.1 17.83,18.84 U3.50
PWRKEY: length 109.1
  Top Layer w0.203: Q3.3 16.92,15.39 C28.2 16.92,12.31 17.32,11.91 18.59,11.91 18.95,11.55 18.95,10 19.27,9.68 v1(22.61,9.68) ; v1(26.29,9.68) 27.17,9.68 D1.1 30.25,6.63 30.25,5.61 29.15,4.51 H3.3 ; v1(56.01,34.19) 55.5,34.69 U4.7
  Bottom Layer w0.203: H3.3 31.76,0.91 38.48,0.91 43.43,5.87 67.94,5.87 68.58,6.5 68.58,33.55 67.94,34.19 v1(56.01,34.19) ; v1(22.61,9.68) v1(26.29,9.68)
RESET_MCU: length 3
  Top Layer w0.203: U3.51 18.33,18.8 18.87,18.26 18.87,18.21 19.2,17.88 19.26,17.88 Q4.1
RESET_N: length 64.2
  Top Layer w0.203: v1(48.51,31.77) 48.14,31.4 U4.15 ; v1(41.66,31.14) 41.66,11.96 v1(39.12,9.42) 38.85,9.69 D4.1 38.1,9.18 38.1,4.09 37.54,3.53 H3.9 ; v1(20.7,15.64) 19.78,15.64 Q4.3
  Bottom Layer w0.203: v1(48.51,31.77) 42.29,31.77 v1(41.66,31.14) ; v1(20.7,15.64) 23.16,15.64 23.88,16.36 25.32,16.36 32.21,9.47 39.06,9.47 v1(39.12,9.42)
RI_MCU: length 17
  Top Layer w0.203: U3.28 19.43,31.53 19.43,36.9 20.34,37.81 U9.15
RTS_MCU: length 22.2
  Top Layer w0.203: v1(20.96,21.99) 20.96,21.23 21.33,20.85 U3.57 ; U9.18 29.86,35.86 29.63,36.09 v1(27.43,36.09)
  Bottom Layer w0.203: v1(27.43,36.09) 27.43,35.2 20.96,28.72 v1(20.96,21.99)
RXD_MCU: length 18.7
  Top Layer w0.203: U3.26 20.43,31.53 20.43,32.45 22.1,34.13 31.39,34.13 31.64,34.38 31.64,38.64 31.17,39.11 U9.13
STATUS: length 37.1
  Top Layer w0.203: v1(50.42,22.12) 51.1,21.44 U4.25 ; Q2.1 27.06,44.85 v1(27.31,44.6)
  Bottom Layer w0.203: v1(27.31,44.6) 27.31,42.19 47.37,22.12 v1(50.42,22.12)
SWCLK: length 21.7
  Top Layer w0.203: U3.46 15.24,22.84 14.31,22.84 13.84,22.36 v1(13.84,21.23)
  Bottom Layer w0.203: v1(13.84,21.23) 15.07,20 15.07,4.97 H2.5
SWDIO: length 22.2
  Top Layer w0.203: v1(13.21,22.38) 14.27,23.43 U3.45
  Bottom Layer w0.203: v1(13.21,22.38) 12.66,21.83 12.66,4.84 H2.3
TXD_MCU: length 19.3
  Top Layer w0.203: U9.12 31.17,39.76 31.95,38.99 31.95,34.26 31.51,33.82 22.3,33.82 20.93,32.45 20.93,31.53 U3.25
USB_BOOT: length 35.5
  Top Layer w0.203: v1(57.15,8.15) 52.5,3.5 H4.2 46.94,3.61 D9.1 ; v1(52.58,25.93) 52.5,25.85 U4.82
  Bottom Layer w0.203: v1(52.58,25.93) 57.15,21.36 v1(57.15,8.15)
USB_DM_TEST: length 47.9
  Top Layer w0.15: R8.1 56.13,9.29 55.68,8.84 40.31,8.84 38.86,7.39 38.86,1.93 30.48,1.93 30.48,4.87 H3.6
  Top Layer w0.203: H3.6 31.69,6.93 D7.1
USB_DP_TEST: length 47.8
  Top Layer w0.203: v1(30.86,8.79) 30.86,9.48 ; 30.86,9.48 D2.1 ; 30.86,9.48 32.89,7.45 32.89,4.72 31.7,3.53 H3.5 ; v1(51.05,9.55) 51.63,10.12 R7.1
  Bottom Layer w0.203: v1(30.86,8.79) 30.73,8.66 25.4,8.66 25.27,8.53 25.27,7.9 25.4,7.77 49.28,7.77 v1(51.05,9.55)
USB_VBUS: length 43.9
  Top Layer w0.254: v1(53.72,21.99) 53.67,22.05 53.67,22.53 U4.61 ; v1(34.16,15.52) 32.64,15.52 U8.3 32.51,15.39 32.51,12.85 32.13,12.47 26.29,12.47 25.91,12.09 25.91,10.15 D8.1 25.45,7.7 25.95,7.2 28.38,7.2 29.15,6.44 H3.4
  Bottom Layer w0.254: v1(34.16,15.52) 47.24,15.52 v1(53.72,21.99)
USIM1_CLK: length 15.7
  Top Layer w0.203: U4.13 48.9,49.17 48.59,49.48 R14.1
USIM1_DATA: length 18.7
  Top Layer w0.203: U4.11 51.1,34.57 50.98,34.45 48.51,34.45 48.26,34.69 48.26,47.35 48.05,47.56 R15.1
USIM1_DET: length 43.1
  Top Layer w0.203: 30.24,56.52 30.37,56.39 30.94,56.39 31.09,56.54 31.09,57.62 31.41,57.94 33.43,57.94 U5.3 33.67,57.69 ; 30.24,56.52 30.24,54.08 CARD1.8 30.57,53.74 v1(32.13,53.74) ; 30.24,56.52 30.24,57.08 ; v1(52.2,30.12) 52.2,31 U4.79
  Bottom Layer w0.203: v1(52.2,30.12) 52.2,30.5 50.55,32.15 50.55,35.33 v1(32.13,53.74)
USIM1_RST: length 21
  Top Layer w0.203: U4.12 50,53.44 49.79,53.65 R13.1
USIM1_VDD: length 58.6
  Top Layer w0.381: 46.63,43.48 R11.2 ; 46.63,43.48 46.3,43.48 45.67,42.85 44.58,42.85 44.38,43.05 44.38,43.76 44.03,44.11 41.13,44.11 40.77,44.47 40.77,50.44 41.1,50.78 43.23,50.78 43.29,50.84 CARD1.1 42.86,50.82 29.88,50.82 29.14,51.56 29.14,59.27 29.34,59.46 34.47,59.46 34.67,59.26 U5.1 ; 46.63,43.48 46.63,41.79 45.31,40.46 45.31,33.34 45.68,32.96 46.34,32.96 U4.14
$1N2161: length 11.7
  Top Layer w0.3: X1.1 32.38,22.38 ; X1.1 34.51,22.36 C11.2 ; X1.1 31.64,22.36 29.06,24.94 29.06,26.14 28.81,26.39 26.88,26.39 U3.10
$1N15878: length 17.4
  Top Layer w0.203: R4.2 8.31,40.66 7.93,41.05 LED1.2
$1N19614: length 11.8
  Top Layer w0.3: C10.2 35.41,25.58 33.37,25.58 32.49,26.46 X1.2 30.75,26.46 30.62,26.59 30.62,27.95 30.35,28.22 28.71,28.22 28.55,28.06 28.55,27.09 28.44,26.98 26.88,26.98 U3.11
$1N19655: length 15.6
  Top Layer w0.203: C9.2 32.48,19.71 29.16,23.03 28.35,23.03 28.09,22.77 28.09,21.77 27.85,21.53 25.81,21.53 25.58,21.77 25.58,24.6 25.81,24.84 26.74,24.84 U3.7
$2N14940: length 9
  Top Layer w0.15: R7.2 53.56,17.41 L1.2 53.41,17.48 51.67,19.22 51.67,22.13 50.7,23.1
$2N14988: length 8.6
  Top Layer w0.15: U4.60 51.9,22.55 52.77,21.67 52.77,19.28 54.13,17.92 L1.3 54.2,17.41 R8.2
$3N1995: length 19.4
  Top Layer w0.203: CARD1.2 43.85,49.28 43.99,49.28 44.14,49.43 44.14,52.66 R13.2 45.12,55.71 C13.2 45.02,55.82 34.27,55.82 34.17,55.92 U5.5
$3N1996: length 24.4
  Top Layer w0.203: CARD1.3 43.85,46.74 43.99,46.74 44.14,46.89 44.14,48.5 R14.2 45.12,51.55 C14.2 45.85,52.31 45.85,56.54 45.34,57.05 33.97,57.05 33.67,56.75 U5.4
$3N2017: length 3.1
  Top Layer w0.203: H4.1 45.14,4.35 R16.2
$3N2032: length 21
  Top Layer w0.203: v1(45.59,48.16) 45.59,48.1 R15.2 45.11,47.51 C15.2 44.35,44.9 43.85,44.9 ; CARD1.7 43.85,44.9 ; 43.85,44.9 R11.1 ; U5.6 35.56,56.41 v1(35.56,56.41)
  Bottom Layer w0.203: v1(45.59,48.16) 37.34,56.41 v1(35.56,56.41)
$3N2037: length 2.9
  Top Layer w0.203: U6.4 56.47,58.5 C27.2
$3N3863: length 4.5
  Top Layer w0.203: C31.2 64.09,16.16 R20.2 RF1.1
$3N3867: length 5
  Top Layer w0.203: C32.1 61.09,42.63 R21.2 61.03,39.84 C34.2
$3N3871: length 5.8
  Top Layer w0.203: C32.2 61.08,45.9 L2.2 60.99,47.86 D11.2 60.83,48.01 RF2.1
$3N3874: length 1.9
  Top Layer w0.203: L2.1 R19.2
$3N4701: length 9.1
  Top Layer w0.203: Q5.3 R22.2 20.95,59.59 21.29,59.94 24.3,59.94
$3N7617: length 6.3
  Top Layer w0.203: R28.1 40.69,38.41 R29.2 40.33,40.41 U9.10
$3N7638: length 4.9
  Top Layer w0.203: R31.2 26.15,35.46 28.19,35.46 29.09,34.56 U9.20
$3N7643: length 2
  Top Layer w0.203: U9.1 36.26,32.85 R30.1
$3N8139: length 4
  Top Layer w0.203: Q6.3 22.56,15.98 R24.1 20.68,14.49 R26.1
$3N8153: length 7.8
  Top Layer w0.203: R24.2 26.07,14.49 C37.2 26.16,14.59 26.16,16.03 26.48,16.34 U8.1
$3N12837: length 4.7
  Top Layer w0.15: R23.1 27.15,66.74 24.3,66.74 24.09,66.96 R27.2
$3N22714: length 2.7
  Top Layer w0.203: R9.1 24.52,49.76 Q1.3
$3N22716: length 18.9
  Top Layer w0.203: R9.2 25.12,46.89 10.03,46.89 9.53,47.39 9.53,49.17 LED2.1
$3N22754: length 2.7
  Top Layer w0.203: R10.1 24.52,44.86 Q2.3
$3N22756: length 19.6
  Top Layer w0.203: R10.2 25.19,42.06 10.64,42.06 9.53,43.17 LED3.1

## Copper pours and planes (outline as drawn; the poured copper is in the pictures)
3V3 on PWR: 3,58.93 54.19,58.93 54.19,2.62 3,2.62
5V on PWR: 0.26,69.74 65.53,69.74 65.53,0.26 0.26,0.26
GND on Top Layer: 0,70 70,70 70,0 0,0
GND on Bottom Layer: 0,70 70,70 70,0 0,0
GND on GND: 0.26,69.74 69.74,69.74 69.74,0.26 0.26,0.26
VBAT on PWR: 10.8,69.74 69.74,69.74 69.74,0.26 10.8,0.26

## Text on the board
Bottom Silkscreen Layer: 2020217781-20230907 | v1.0 | Created By Shang Wentao | 电动自行车定位监测终端
Document Layer: VBAT | GND | USB_VBUS | PWRKEY | USB_DM | USB_DP | DBG_RXD | DBG_TXD | VDD_EXT | RESET_N | 注意事项： / * USB_DP/DM要求90欧姆阻抗差分线设计。走线尽量短。内层走线且立体包地处理。远离晶振、射频信号。 / * VBAT线宽不小于2mm。原则上VBAT走线越长，线宽越宽。 / * RESET_N对干扰敏感，走线尽量短，包地处理。 / * USIM走线长度不超过200mm，远离射频和VBAT电源线。USIM_CLK和USIM_DATA布线不能太靠近，在两条走线之间需增加地屏蔽，防止信号串扰。 / * 射频线50欧姆阻抗匹配。避免直角走线。在信号线和参考地周边增加一定量的地孔可以帮助提升射频性能。地孔和信号线之间的距离应至少2倍线宽。远离干扰源，避免和相邻层的任何信号线交叉或平行。
Top Silkscreen Layer: GND | NET_STATUS | STATUS | POWER | TXD | DIO | CLK | RXD | 3V3 | BUS | PWR | DM | DP | EXT | RST | BOOT | GNSS | 4G | 5V | BAT
